# EAGLE schematic SuperGreatPI_v03 (EAGLE 9.0.1)
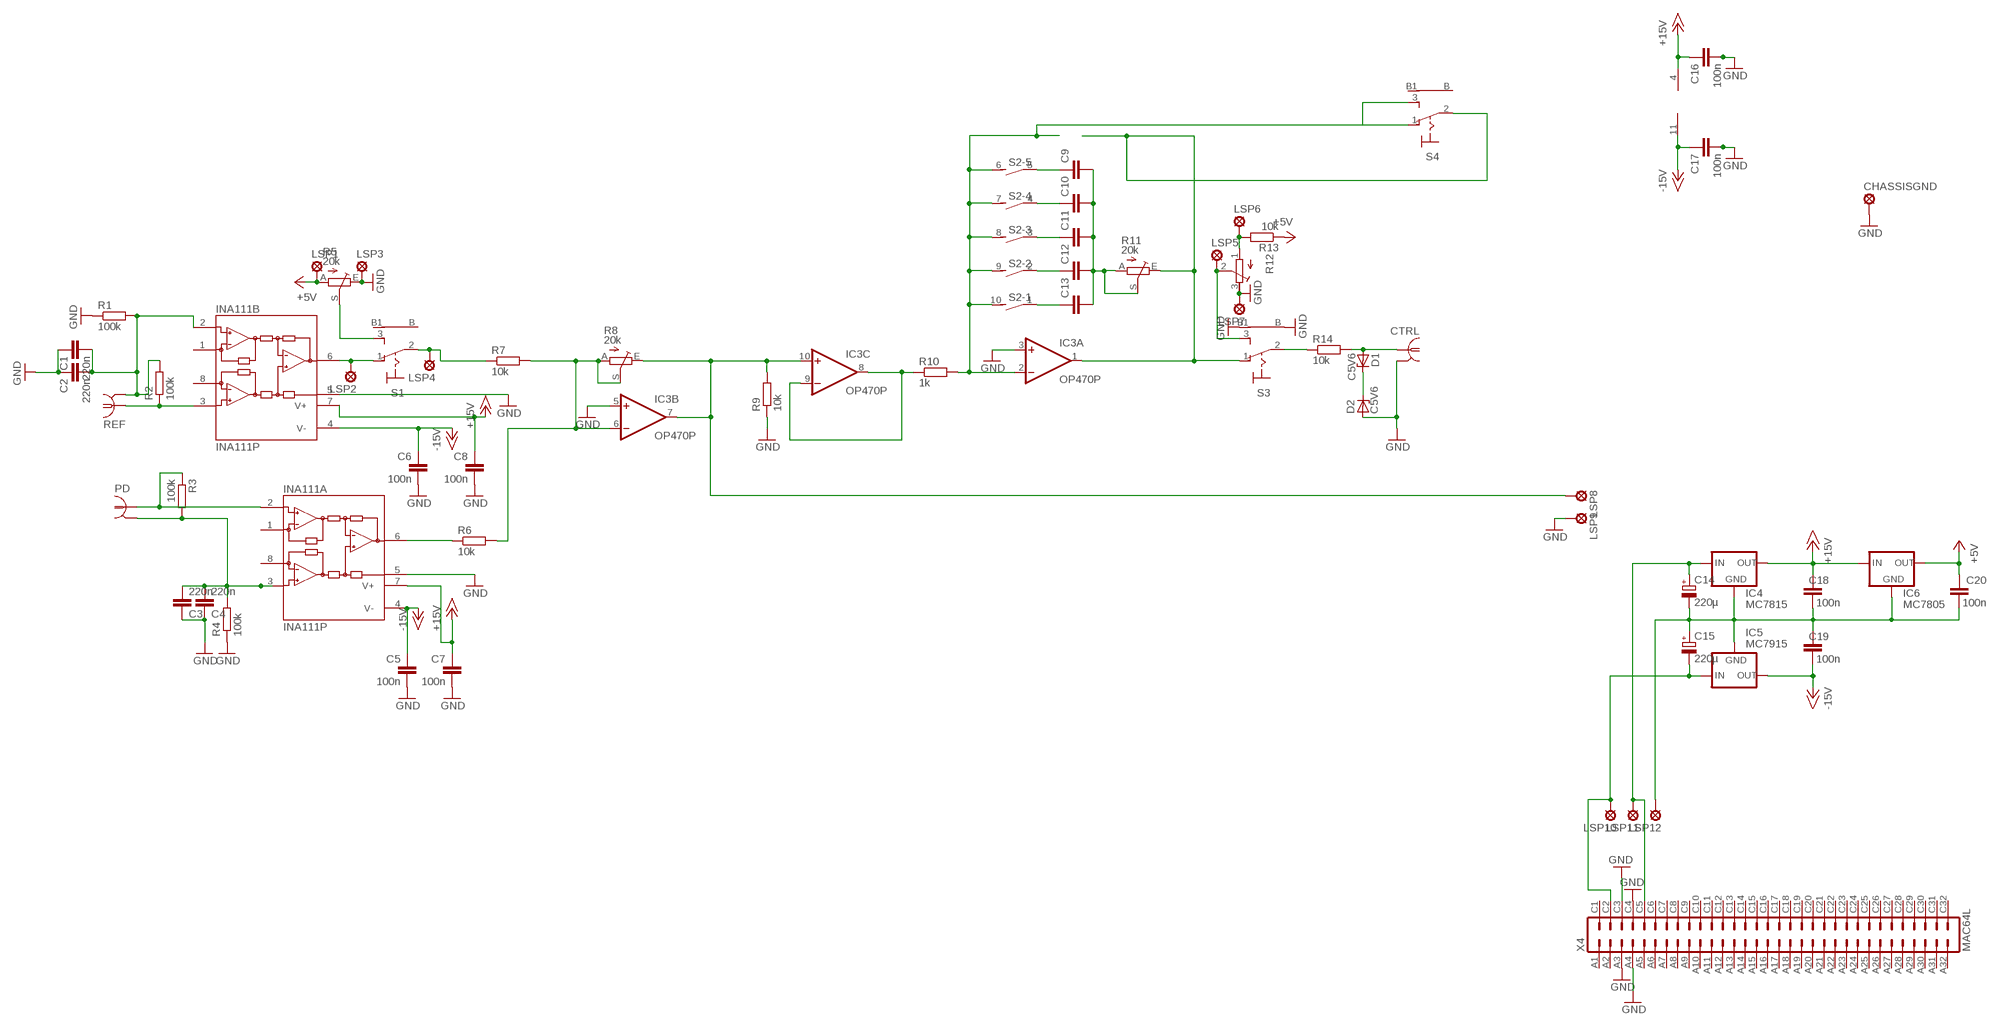
[diagram p0: schematic, sheet 1]

## Parts
C1  220n  C-EU025-024X044  [C025-024X044]
C2  220n  C-EU025-024X044  [C025-024X044]
C3  220n  C-EU025-024X044  [C025-024X044]
C4  220n  C-EU025-024X044  [C025-024X044]
C5  100n  C-EU025-024X044  [C025-024X044]
C6  100n  C-EU025-024X044  [C025-024X044]
C7  100n  C-EU025-024X044  [C025-024X044]
C8  100n  C-EU025-024X044  [C025-024X044]
C9  C-EU050-025X075  [C050-025X075]
C10  C-EU050-025X075  [C050-025X075]
C11  C-EU050-025X075  [C050-025X075]
C12  C-EU050-025X075  [C050-025X075]
C13  C-EU050-025X075  [C050-025X075]
C14  220µ  CPOL-EUE3.5-8  [E3,5-8]
C15  220µ  CPOL-EUE3.5-8  [E3,5-8]
C16  100n  C-EU025-024X044  [C025-024X044]
C17  100n  C-EU025-024X044  [C025-024X044]
C18  100n  C-EU025-024X044  [C025-024X044]
C19  100n  C-EU025-024X044  [C025-024X044]
C20  100n  C-EU025-024X044  [C025-024X044]
CHASSISGND  MCS08  [MCS08]
CTRL  1-227161-0  [AMP_227161]
D1  C5V6  BZX90  [DO34Z7]
D2  C5V6  BZX90  [DO34Z7]
IC3  OP470P  [DIL14]
IC4  MC7815  78XXS  [78XXS]
IC5  MC7915  79XXS  [79XXS]
IC6  MC7805  78XXS  [78XXS]
INA111A  INA111P  [DIL08]
INA111B  INA111P  [DIL08]
LSP1  MCS08  [MCS08]
LSP2  MCS08  [MCS08]
LSP3  MCS08  [MCS08]
LSP4  MCS08  [MCS08]
LSP5  MCS08  [MCS08]
LSP6  MCS08  [MCS08]
LSP7  MCS08  [MCS08]
LSP8  MCS08  [MCS08]
LSP9  MCS08  [MCS08]
LSP10  -18V  MCS08  [MCS08]
LSP11  -18V  MCS08  [MCS08]
LSP12  GND  MCS08  [MCS08]
PD  1-227161-0  [AMP_227161]
R1  100k  R-EU_0207/2V  [0207/2V]
R2  100k  R-EU_0207/2V  [0207/2V]
R3  100k  R-EU_0207/2V  [0207/2V]
R4  100k  R-EU_0207/2V  [0207/2V]
R5  20k  TRIM_EU-PTSPIN  [PT-SPIN]
R6  10k  R-EU_0207/10  [0207/10]
R7  10k  R-EU_0207/10  [0207/10]
R8  20k  TRIM_EU-PTSPIN  [PT-SPIN]
R9  10k  R-EU_0207/10  [0207/10]
R10  1k  R-EU_0207/10  [0207/10]
R11  20k  TRIM_EU-PTSPIN  [PT-SPIN]
R12  R-TRIMM3299W  [RTRIM3299W]
R13  10k  R-EU_0207/10  [0207/10]
R14  10k  R-EU_0207/10  [0207/10]
REF  1-227161-0  [AMP_227161]
S1  LPV-1  [LPV-1]
S2  DS05E  [DS-05]
S3  LPV-1  [LPV-1]
S4  LPV-1  [LPV-1]
X4  MAC64L  [MAC64L]

## Nets
+5V: C20.1 IC6.OUT LSP1.MP R5.A R13.1
+15V: C7.1 C8.1 C16.1 C18.1 IC3.4(P:V+) IC4.OUT IC6.IN INA111A.7(V+) INA111B.7(V+)
-15V: C5.1 C6.1 C17.1 C19.2 IC3.11(P:V-) IC5.OUT INA111A.4(V-) INA111B.4(V-)
GND: C1.1 C2.1 C3.1 C4.1 C5.2 C6.2 C7.2 C8.2 C14.- C15.+ C16.2 C17.2 C18.2 C19.1 C20.2 CHASSISGND.MP CTRL.2(GND) D2.A IC3.3(A:+IN) IC3.5(B:+IN) IC4.GND IC5.GND IC6.GND INA111A.5(REF) INA111B.5(REF) LSP3.MP LSP7.MP LSP9.MP LSP12.MP R1.1 R4.1 R5.E R9.1 R12.3(E) S3.B S3.B1 X4.A3 X4.A4 X4.C3 X4.C4
N$13: IC3.8(C:OUT) IC3.9(C:-IN) R10.1
N$16: INA111A.6(OUT) R6.1
N$17: INA111B.3(+IN) R2.1 REF.1
N$18: INA111A.2(-IN) PD.1 R3.1
N$22: C1.2 C2.2 INA111B.2(-IN) R1.2 R2.2 REF.2(GND)
N$23: C3.2 C4.2 INA111A.3(+IN) PD.2(GND) R3.2 R4.2
N$28: C14.+ IC4.IN LSP11.MP X4.C5
N$29: IC3.7(B:OUT) IC3.10(C:+IN) LSP8.MP R8.E R9.2
N$33: CTRL.1 D1.A R14.2
N$36: IC3.2(A:-IN) R10.2 S2.6 S2.7 S2.8 S2.9 S2.10 S4.1(O) S4.3(S)
N$38: C15.- IC5.IN LSP10.MP X4.C2
N$42: C9.2 C10.2 C11.2 C12.2 C13.2 R11.A R11.S
N$44: LSP4.MP R7.1 S1.2(P)
N$45: IC3.1(A:OUT) R11.E S3.1(O) S4.2(P)
N$46: IC3.6(B:-IN) R6.2 R7.2 R8.A R8.S
N$49: R5.S S1.3(S)
N$50: C9.1 S2.5
N$54: C10.1 S2.4
N$55: C11.1 S2.3
N$56: C12.1 S2.2
N$57: C13.1 S2.1
N$58: INA111B.6(OUT) LSP2.MP S1.1(O)
N$59: LSP6.MP R12.1(A) R13.2
N$60: R14.1 S3.2(P)
N$61: LSP5.MP R12.2(S) S3.3(S)
N$62: D1.C D2.C
Unconnected: IC3.12(D:+IN) IC3.13(D:-IN) IC3.14(D:OUT) INA111A.1(RG) INA111A.8(RG) INA111B.1(RG) INA111B.8(RG) S1.B S1.B1 S4.B S4.B1 X4.A1 X4.A2 X4.A5 X4.A6 X4.A7 X4.A8 X4.A9 X4.A10 X4.A11 X4.A12 X4.A13 X4.A14 X4.A15 X4.A16 X4.A17 X4.A18 X4.A19 X4.A20 X4.A21 X4.A22 X4.A23 X4.A24 X4.A25 X4.A26 X4.A27 X4.A28 X4.A29 X4.A30 X4.A31 X4.A32 X4.C1 X4.C6 X4.C7 X4.C8 X4.C9 X4.C10 X4.C11 X4.C12 X4.C13 X4.C14 X4.C15 X4.C16 X4.C17 X4.C18 X4.C19 X4.C20 X4.C21 X4.C22 X4.C23 X4.C24 X4.C25 X4.C26 X4.C27 X4.C28 X4.C29 X4.C30 X4.C31 X4.C32

## Library data of the parts
C1-C13 C16-C20 = rcl:C-EU: CAPACITOR, European symbol
C14 C15 = rcl:CPOL-EU: POLARIZED CAPACITOR, European symbol
CHASSISGND LSP1-LSP12 = solpad:MCS08: SOLDER PAD MC S0,8, drill 1.2 mm, distributor Buerklin, 08F130
CTRL PD REF = con-coax:?227161*: JACK, RIGHT ANGLE, 50 OHM, PCB, BNC Source: amp_227161.pdf
D1 D2 = diode:BZX90: Z DIODE
IC3 = linear:OP470: OP AMP
IC4 IC6 = v-reg:78XXS: VOLTAGE REGULATOR
IC5 = v-reg:79XXS: VOLTAGE REGULATOR
INA111A INA111B = burr-brown:INA111: Instrumentation Amplifier High Speed FET-Input
R1-R4 R6 R7 R9 R10 R13 R14 = rcl:R-EU_: RESISTOR, European symbol
R5 R8 R11 = pot:TRIM_EU-: POTENTIOMETER
R12 = resistor:R-TRIMM: Trimm resistor
S1 S3 S4 = switch:LPV-1: TOGGLE SWITCH
S2 = switch-dil:DS05E: DIL/CODE SWITCH
X4 = con-vg:MAC64L: CONNECTOR male, 64 pins, block, type C, rows AC, grid 5.08 mm